# EAGLE design schema (EAGLE 9.6.2)
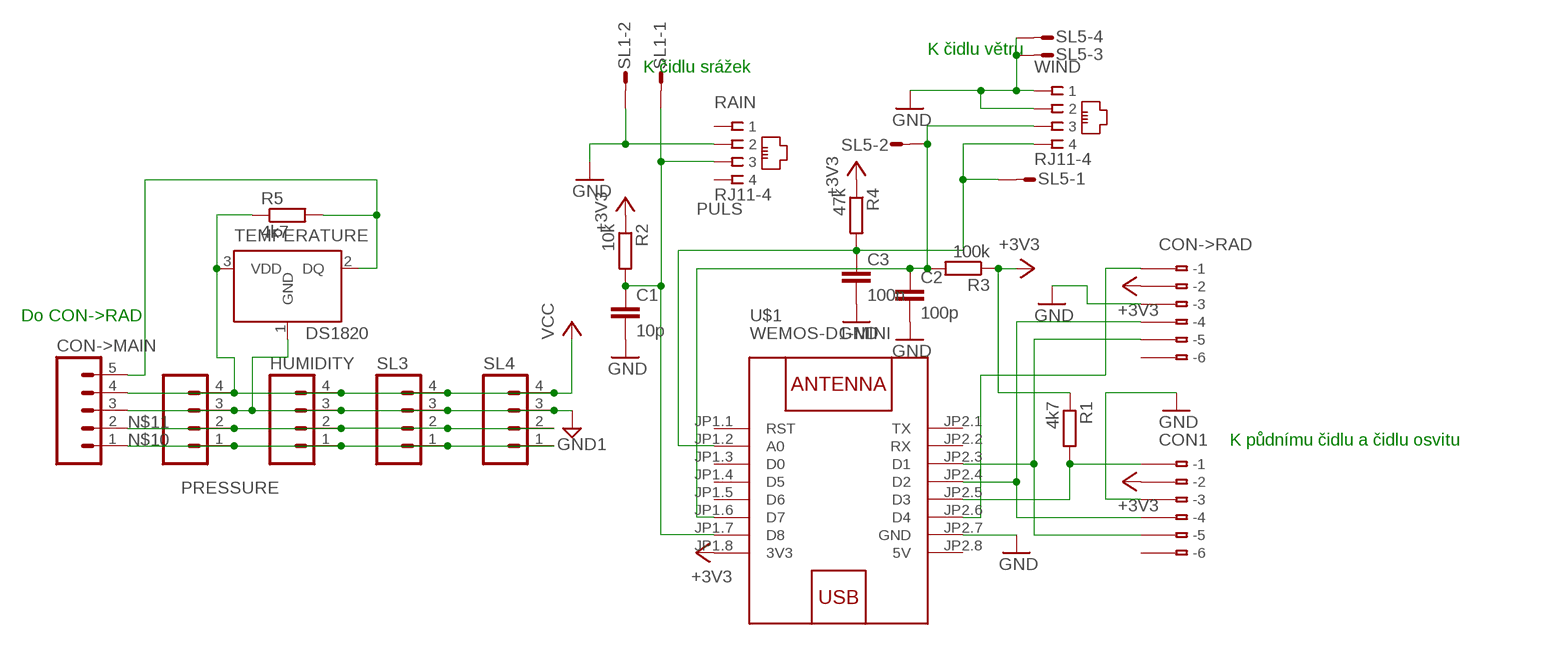
[diagram p0: schematic, sheet 1]

## Parts
C1  10p  C-EU025-024X044  [C025-024X044]
C2  100p  C-EU025-024X044  [C025-024X044]
C3  100n  C-EU025-024X044  [C025-024X044]
CON1  233-506  [233-506]
CON->MAIN  M05  [05P]
CON->RAD  233-506  [233-506]
HUMIDITY  M04  [04P]
PRESSURE  M04  [04P]
R1  4k7  R-EU_0204/7  [0204/7]
R2  10k  R-EU_0204/7  [0204/7]
R3  100k  R-EU_0204/7  [0204/7]
R4  47k  R-EU_0204/7  [0204/7]
R5  4k7  R-EU_0204/7  [0204/7]
RAIN  RJ11-4  [RJ11-4]
SL1  M02S  [02P]
SL3  M04  [04P]
SL4  M04  [04P]
SL5  M04S  [04P]
TEMPERATURE  DS1820  [TO-92]
U$1  WEMOS-D1-MINI  [WEMOS-D1-MINI]
WIND  RJ11-4  [RJ11-4]

## Nets
+3V3: CON1.B2(B-2) CON->RAD.B2(B-2) R1.1 R2.1 R3.1 R4.1 U$1.JP1.8(3V3)
GND: C1.2 C2.2 C3.2 CON1.B3(B-3) CON->RAD.B3(B-3) RAIN.2 SL1.2 SL5.3 SL5.4 U$1.JP2.7(GND) WIND.1 WIND.2
GND1: CON->MAIN.3 HUMIDITY.3 PRESSURE.3 SL3.3 SL4.3 TEMPERATURE.1(GND)
N$9: CON->MAIN.5 R5.2 TEMPERATURE.2(DQ)
N$10: CON->MAIN.1 HUMIDITY.1 PRESSURE.1 SL3.1 SL4.1
N$11: CON->MAIN.2 HUMIDITY.2 PRESSURE.2 SL3.2 SL4.2
N$13: CON1.B1(B-1) R1.2 U$1.JP2.5(D3)
N$14: CON->RAD.B1(B-1) U$1.JP2.6(D4)
PULS: C1.1 R2.2 RAIN.3 SL1.1 U$1.JP1.7(D8)
RYCHLOST: C2.1 R3.2 SL5.2 U$1.JP1.6(D7) WIND.3
SCL: CON1.B5(B-5) CON->RAD.B5(B-5) U$1.JP2.3(D1)
SDA: CON1.B4(B-4) CON->RAD.B4(B-4) U$1.JP2.4(D2)
SMER: C3.1 R4.2 SL5.1 U$1.JP1.2(A0) WIND.4
VCC: CON->MAIN.4 HUMIDITY.4 PRESSURE.4 R5.1 SL3.4 SL4.4 TEMPERATURE.3(VDD)
Unconnected: CON1.A1(-1) CON1.A2(-2) CON1.A3(-3) CON1.A4(-4) CON1.A5(-5) CON1.A6(-6) CON1.B6(B-6) CON->RAD.A1(-1) CON->RAD.A2(-2) CON->RAD.A3(-3) CON->RAD.A4(-4) CON->RAD.A5(-5) CON->RAD.A6(-6) CON->RAD.B6(B-6) RAIN.1 RAIN.4 U$1.JP1.1(RST) U$1.JP1.3(D0) U$1.JP1.4(D5) U$1.JP1.5(D6) U$1.JP2.1(TX) U$1.JP2.2(RX)

## Notes on the sheet
- K čidlu větru
- K čidlu srážek
- Do CON->RAD
- K půdnímu čidlu a čidlu osvitu

## Power pins joined to a net without a drawn wire
5V: U$1.JP2.8(5V)

## Library data of the parts
C1-C3 = rcl:C-EU: CAPACITOR, European symbol; SPICEPREFIX: C
CON1 CON->RAD = con-wago:233-506: WAGO Cage Clamp; MF: Wago Corporation; MPN: 0233-0506; OC_FARNELL: 1777100; OC_NEWARK: 79K2052
CON->MAIN = con-amp-quick:M05: AMP QUICK CONNECTOR; OC_FARNELL: unknown; OC_NEWARK: unknown
HUMIDITY PRESSURE SL3 SL4 = con-amp-quick:M04: AMP QUICK CONNECTOR; OC_FARNELL: unknown; OC_NEWARK: unknown
R1-R5 = rcl:R-EU_: RESISTOR, European symbol; SPICEPREFIX: R
RAIN WIND = pf:RJ11-4: 4 pin
SL1 = con-amp-quick:M02S: AMP QUICK CONNECTOR; OC_FARNELL: unknown; OC_NEWARK: unknown
SL5 = con-amp-quick:M04S: AMP QUICK CONNECTOR; OC_FARNELL: unknown; OC_NEWARK: unknown
TEMPERATURE = DS1820:DS1820: DS1820 - 1-Wire Digital Thermometer
U$1 = Wemos_Boards:WEMOS-D1-MINI: WEMOS D1 mini: Mini Wi-Fi Board based on ESP-8266 device More details can be found here: https://www.wemos.cc/product/d1-mini.html Click here to find device on ebay.com <http://www.ebay.com/sch/wemos+d1+mini+nodemcu>

## Board
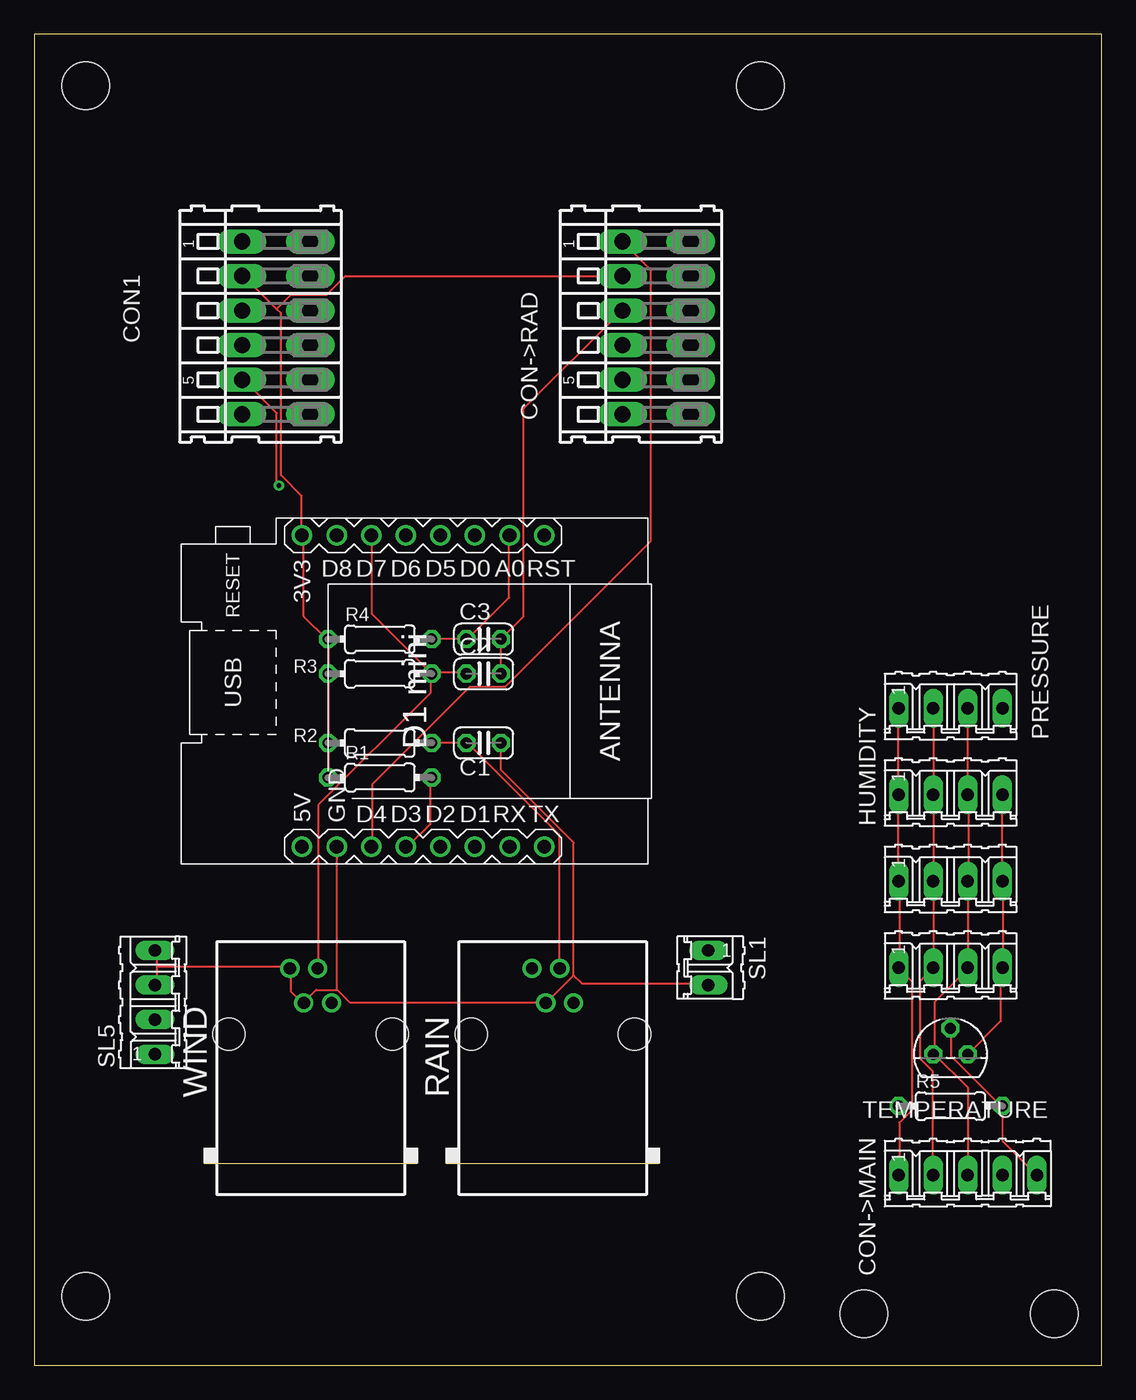
[diagram p1: board, top side]
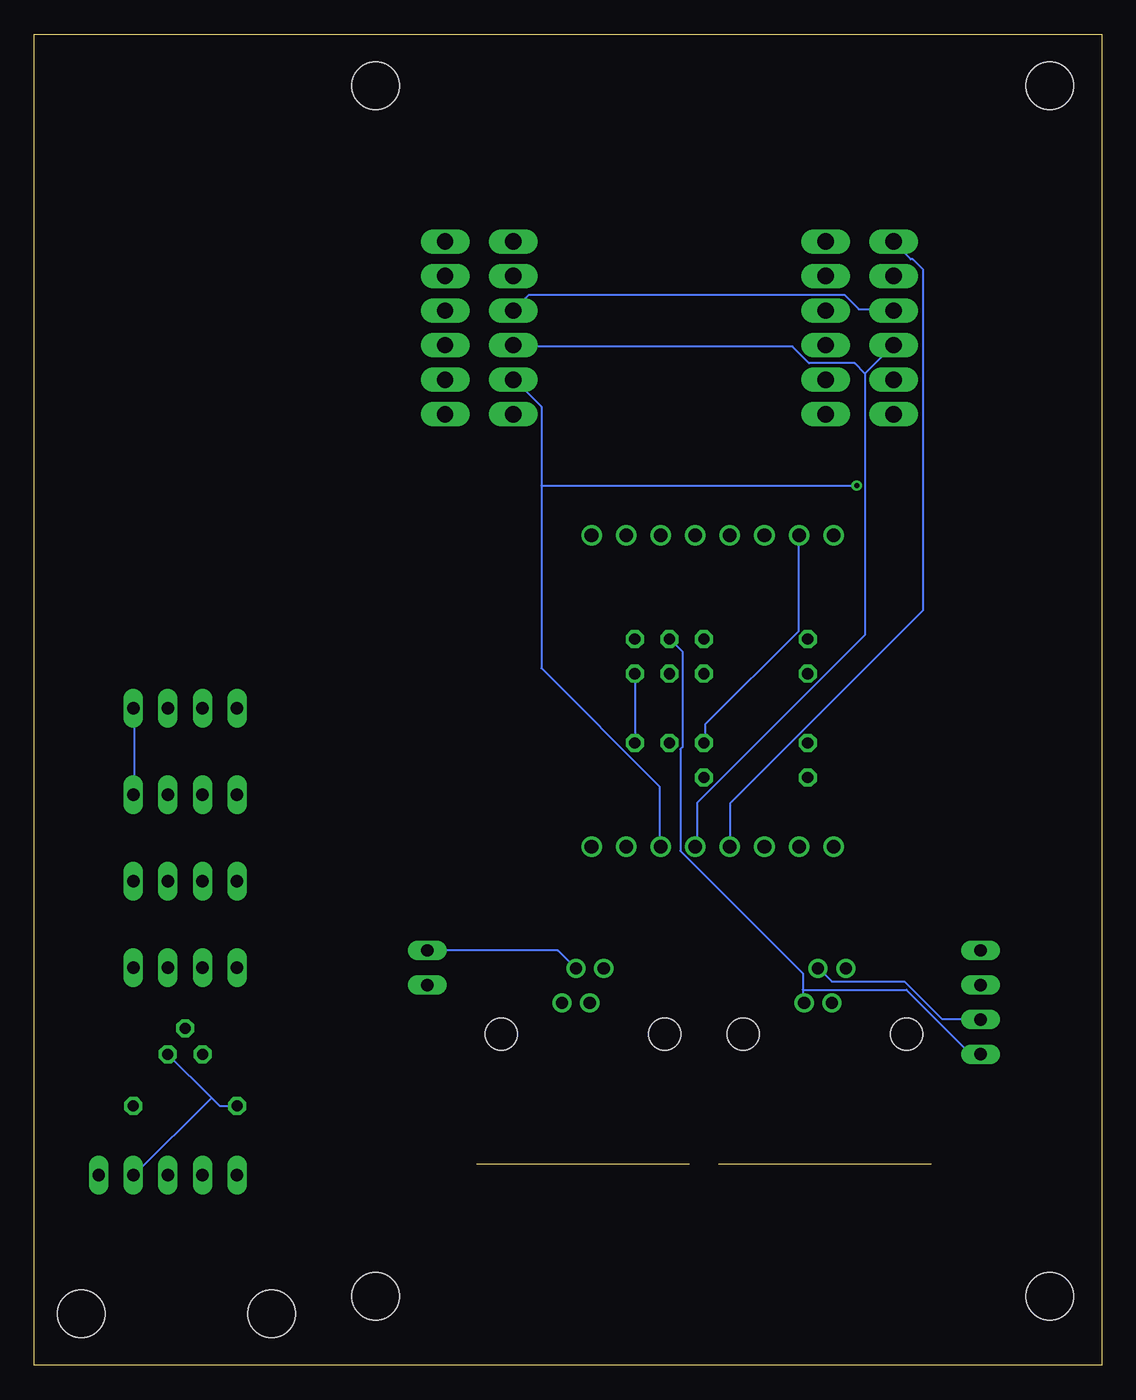
[diagram p2: board, bottom side, seen from below]

Size 78.41 x 97.78 mm. Coordinates in mm from the lower left corner, seen from the top.
Outline: 0,0 78.41,0 78.41,97.78 0,97.78 0,0
Copper layers (1*16): Top 0.035mm / dielectric 1.5mm / Bottom 0.035mm
Design rules "default": minimum track width 6mil, minimum drill 0.35mm, track to track 6mil, track to pad 6mil, pad to pad 6mil, via to via 6mil, smd to smd 6mil, copper to edge 40mil, drill to drill 6mil, minimum pad ring 10mil, minimum via ring 8mil, stop-mask expansion 4mil, vias tented up to drill 0mil, thermal gap 10mil
Holes 3.5 mm at 60.96,3.81 74.93,3.81 3.81,5.08 53.34,5.08 3.81,93.98 53.34,93.98

### Footprints (pad centres in the part's own frame; a part is rotated, then mirrored left to right if it is on the bottom)
C025-024X044 = drill 0.813 octagon: 1 -1.27,0; 2 1.27,0
233-506 = drill 1.2 long: A1 -6.35,2.5; A2 -3.81,2.5; A3 -1.27,2.5; A4 1.27,2.5; A5 3.81,2.5; A6 6.35,2.5; B1 -6.35,-2.5; B2 -3.81,-2.5; B3 -1.27,-2.5; B4 1.27,-2.5; B5 3.81,-2.5; B6 6.35,-2.5
05P = drill 0.914 long: 1 -5.08,0; 2 -2.54,0; 3 0,0; 4 2.54,0; 5 5.08,0
04P = drill 0.914 long: 1 -3.81,0; 2 -1.27,0; 3 1.27,0; 4 3.81,0
0204/7 = drill 0.813 octagon: 1 -3.81,0; 2 3.81,0
RJ11-4 = drill 0.9 pad 1.4: 1 -1.53,8.84; 2 -0.51,6.3; 3 0.51,8.84; 4 1.53,6.3 | hole 2.36: -6,4; 6,4
02P = drill 0.914 long: 1 -1.27,0; 2 1.27,0
TO-92 = drill 0.813 pad 1.27 octagon: 1 -1.27,0; 2 0,1.905; 3 1.27,0
WEMOS-D1-MINI = drill 1: JP1.1 -11.43,9.525; JP1.2 -11.43,6.985; JP1.3 -11.43,4.445; JP1.4 -11.43,1.905; JP1.5 -11.43,-0.635; JP1.6 -11.43,-3.175; JP1.7 -11.43,-5.715; JP1.8 -11.43,-8.255; JP2.1 11.43,9.525; JP2.2 11.43,6.985; JP2.3 11.43,4.445; JP2.4 11.43,1.905; JP2.5 11.43,-0.635; JP2.6 11.43,-3.175; JP2.7 11.43,-5.715; JP2.8 11.43,-8.255

### Placement (x,y rotation side)
C1  33.02,45.72 0 top
C2  33.02,50.8 0 top
C3  33.02,53.34 0 top
CON1  17.78,76.2 270 top
CON->MAIN  68.58,13.97 0 top
CON->RAD  45.72,76.2 270 top
HUMIDITY  67.31,41.91 0 top
PRESSURE  67.31,48.26 0 top
R1  25.4,43.18 0 top
R2  25.4,45.72 0 top
R3  25.4,50.8 0 top
R4  25.4,53.34 0 top
R5  67.31,19.05 0 top
RAIN  38.1,20.32 0 top
SL1  49.53,29.21 270 top
SL3  67.31,35.56 0 top
SL4  67.31,29.21 0 top
SL5  8.89,26.67 90 top
TEMPERATURE  67.31,22.86 0 top
U$1  27.94,49.53 270 top
WIND  20.32,20.32 0 top

### Tracks (layer width: path | path; a pad name or v marks a point on that pad's centre or on a via)
+3V3
  Top 0.152: 21.64,45.72 21.64,43.28 R1.1 | 21.64,45.72 21.64,50.75 R3.1 21.64,50.9 21.64,53.34 R4.1 21.49,53.34 19.81,55.02 19.81,60.96 U$1.JP1.8 19.66,60.96 19.66,63.86 18.14,65.38 18.14,77.27 17.83,77.57 | 21.64,45.72 R2.1 | 17.83,77.57 15.39,80.01 CON1.B2 | CON->RAD.B2 22.86,80.01 21.49,78.64 18.9,78.64 17.83,77.57
GND
  Top 0.152: C2.2 C3.2 35.97,55.02 35.97,70.26 43.13,77.42 CON->RAD.B3 | 22.25,27.58 23.16,26.67 37.49,26.67 RAIN.2 37.64,26.67 39.62,28.65 | 22.25,27.58 20.73,27.58 19.81,26.67 WIND.2 19.66,26.67 18.9,27.43 18.9,29.11 WIND.1 18.75,29.26 8.99,29.26 | 22.25,27.58 22.25,38.1 U$1.JP2.7 | C1.2 34.29,43.74 39.62,38.41 39.62,28.65 | 8.99,29.26 8.99,30.48 SL5.4 | 8.99,29.26 8.99,28.04 SL5.3 | 39.62,28.65 40.23,28.04 49.53,28.04 SL1.2
  Bottom 0.152: CON1.B3 15.39,77.57 17.83,77.57 18.9,78.64 42.06,78.64 43.13,77.57 CON->RAD.B3 | C2.2 C1.2
GND1
  Top 0.152: 66.14,22.86 66.14,26.67 68.58,29.11 SL4.3 SL3.3 68.63,35.56 68.63,41.91 HUMIDITY.3 PRESSURE.3 | CON->MAIN.3 68.58,20.42 66.14,22.86 | 66.14,22.86 TEMPERATURE.1
N$9
  Top 0.152: CON->MAIN.5 71.17,16.46 71.17,19.05 R5.2 71.02,19.05 67.36,22.71 67.36,24.69 TEMPERATURE.2
N$10
  Top 0.152: 63.45,41.91 63.45,48.16 PRESSURE.1 | 63.45,41.91 63.45,35.56 SL3.1 63.55,35.51 63.55,29.26 SL4.1 63.55,29.11 64.47,28.19 64.47,18.75 63.55,17.83 63.55,14.02 CON->MAIN.1 | 63.45,41.91 HUMIDITY.1
N$11
  Top 0.152: PRESSURE.2 HUMIDITY.2 SL3.2 SL4.2 65.99,29.11 65.08,28.19 65.08,22.55 65.99,21.64 65.99,14.02 CON->MAIN.2
N$13
  Top 0.152: R1.2 29.11,43.13 29.11,39.78 27.43,38.1 U$1.JP2.5
  Bottom 0.152: CON1.B1 15.24,82.45 14.02,81.23 13.87,81.23 13.11,80.47 13.11,55.47 27.28,41.3 27.28,38.1 U$1.JP2.5
N$14
  Top 0.152: U$1.JP2.6 24.84,38.1 24.84,42.67 32,49.84 34.59,49.84 45.26,60.5 45.26,80.47 43.28,82.45 CON->RAD.B1
PULS
  Top 0.152: R2.2 C1.1 31.85,45.72 38.56,39.01 38.56,29.26 RAIN.3
  Bottom 0.152: U$1.JP1.7 22.25,60.96 22.25,53.95 29.11,47.09 29.11,45.72 R2.2 | SL1.1 39.93,30.48 38.71,29.26 RAIN.3
RYCHLOST
  Top 0.152: R3.2 29.26,50.9 31.7,50.9 C2.1 | WIND.3 20.88,29.26 20.88,41.15 29.11,49.38 29.11,50.75 R3.2 | R3.2 24.84,55.17 24.84,60.96 U$1.JP1.6
  Bottom 0.152: SL5.2 8.99,25.45 11.73,25.45 14.48,28.19 19.81,28.19 20.73,29.11 WIND.3
SCL  (via drill 0.35)
  Top 0.152: v17.98,64.62 17.83,64.77 17.83,69.95 15.39,72.39 CON1.B5
  Bottom 0.152: 41.15,64.62 41.15,70.41 43.13,72.39 CON->RAD.B5 | 41.15,64.62 41.15,51.21 32.46,42.52 32.46,38.1 U$1.JP2.3 | 41.15,64.62 v17.98,64.62
SDA
  Bottom 0.152: 17.37,72.85 17.37,53.65 29.72,41.3 29.72,38.1 U$1.JP2.4 | 17.37,72.85 15.39,74.83 CON1.B4 | 17.37,72.85 18.14,73.61 21.49,73.61 22.71,74.83 43.13,74.83 CON->RAD.B4
SMER
  Top 0.152: R4.2 C3.1 31.85,53.34 34.9,56.39 34.9,60.96 U$1.JP1.2
  Bottom 0.152: 21.95,27.58 21.95,28.8 30.94,37.8 30.94,45.26 30.79,45.41 30.79,52.43 31.7,53.34 C3.1 | 21.95,27.58 21.95,26.67 WIND.4 | SL5.1 9.6,22.86 14.33,27.58 21.95,27.58
VCC
  Top 0.152: HUMIDITY.4 71.07,41.91 71.07,35.56 SL3.4 71.17,35.51 71.17,29.26 SL4.4 71.02,29.11 71.02,25.3 TEMPERATURE.3
  Bottom 0.152: 71.02,47.24 71.02,48.26 PRESSURE.4 71.02,47.24 | 71.02,47.24 71.02,41.91 HUMIDITY.4 | R5.1 64.77,19.05 65.38,19.66 | TEMPERATURE.3 65.38,19.66 | 65.38,19.66 71.02,14.02 CON->MAIN.4